# EasyEDA Pro project ProDoc_Board_ZL_C-TH_v1.epro

# Board Tester-TH
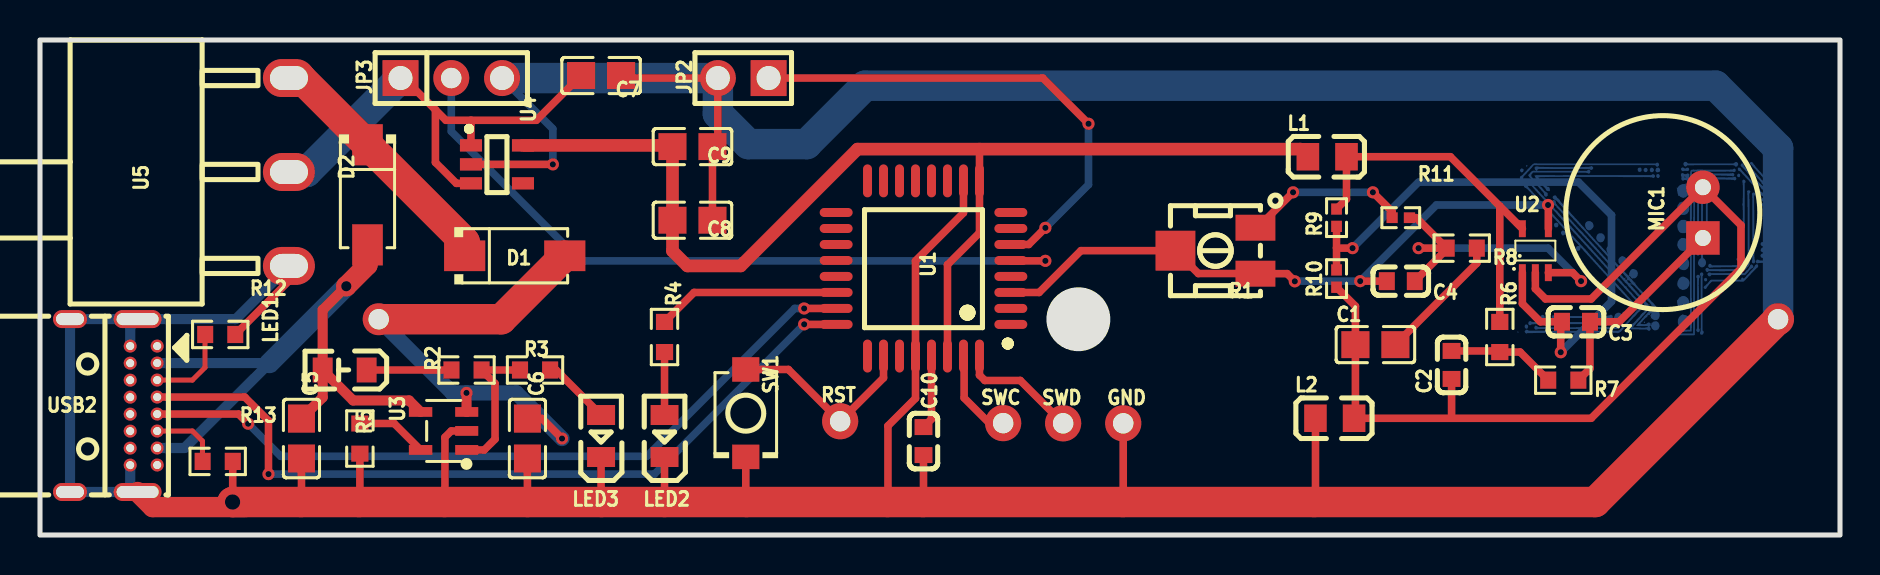
[diagram p0: board, top side]
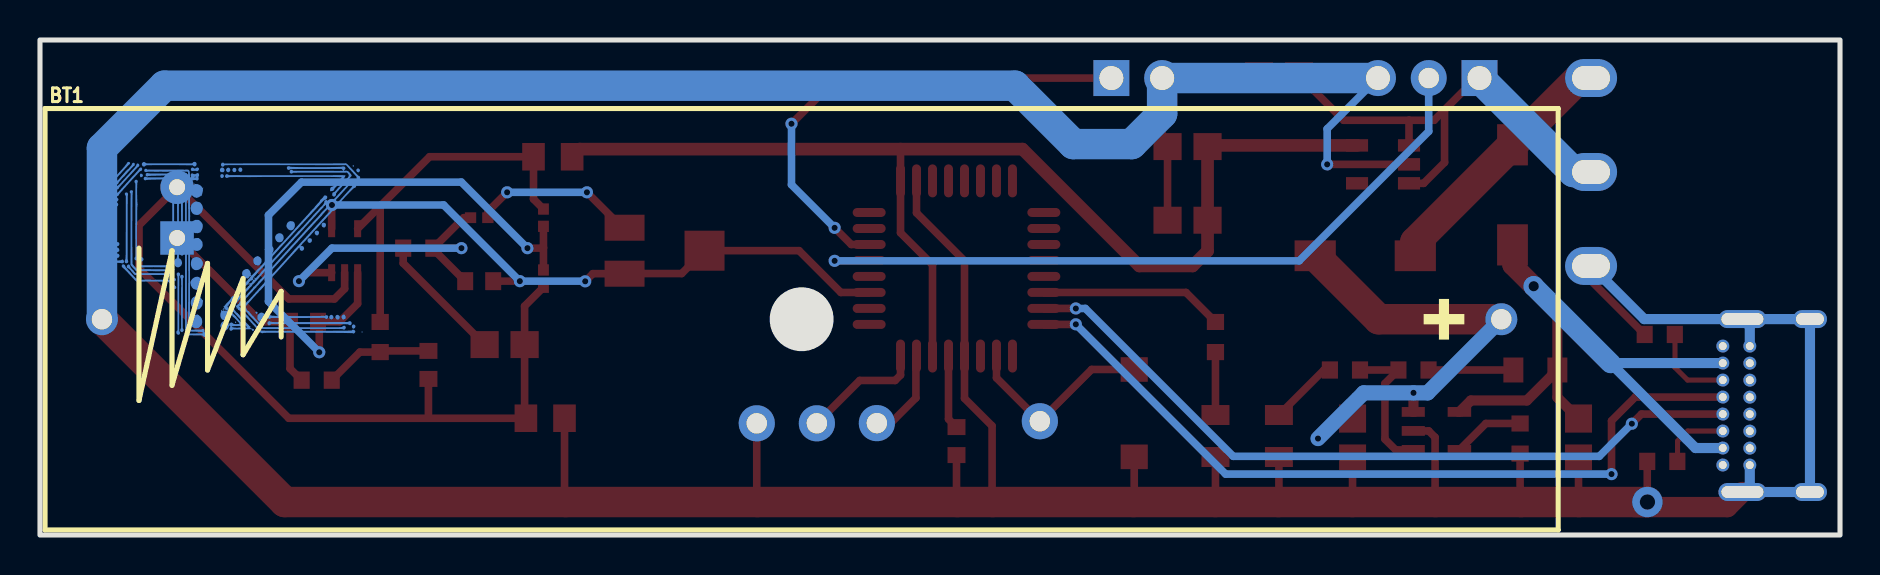
[diagram p1: board, bottom side, seen from below]

Outline 90.04 x 24.77 mm; copper layers: Top Layer, Bottom Layer. Coordinates in mm from the lower left corner of the outline.
Outline path: rectangle 0,24.77 90.04,0
Stack: Top Layer 0.035mm / Dielectric1 1.51mm FR4 er 4.5 / Bottom Layer 0.035mm

## Design rules (mm)
template: JLCPCB Capability(Two Layers Board)
spacing copperThickness1oz (default): track to track 0.102, other pairs 0.152 to 0.3
spacing copperThickness2oz: track to track 0.203, other pairs 0.152 to 0.3
track width copperThickness1oz (default): min 0.127, default 0.254, max 2.54
track width copperThickness2oz: min 0.203, default 0.254, max 2.54
differential pair differentialPair (default): width min 0.127, default 0.254, max 2.54; gap min 0.152, default 0.152
via viaSize (default): diameter min 0.5, default 0.61, max 10; hole min 0.3, default 0.305, max 6.3

## Placement (name value [footprint] x y rotation side)
BT1  BH-18650-1  [BAT-TH_BH-18650-A1AJ005]  51.94 10.8 180 bottom
C1  10uF  [C0805]  66.8 9.53 0 top
C2  100nF  [C0603]  70.61 8.51 90 top
C3  10nF  [C0603]  76.84 10.67 180 top
C4  100pF  [C0603]  68.07 12.7 180 top
C5  10uF  [C0805]  13.08 4.83 270 top
C6  10uF  [C0805]  24.38 4.83 270 top
C7  10uF  [C0805]  28.07 22.99 180 top
C8  10uF  [C0805]  32.64 15.75 180 top
C9  1uF  [C0805]  32.64 19.43 180 top
C10  1uF  [C0603]  44.2 4.7 270 top
D1  SS54  [SMA_L4.4-W2.8-LS5.4-R-RD]  23.75 13.97 0 top
D2  SS54  [SMA_L4.4-W2.8-LS5.4-R-RD]  16.38 17.02 270 top
GND  SWD1  [CON_PAD_ROUND_1.02MM]  54.19 5.59 0 top
JP2  2-Pin  [HDR-TH_2P-P2.54-V-M-2]  35.18 22.86 90 top
JP3  3-Pin  [HDR-TH_3P-P2.54-V-F_MF254V-11-03-0743]  20.57 22.86 0 top
L1  BLM21PG221SN1D  [L0805]  64.39 18.92 0 top
L2  BLM21PG221SN1D  [L0805]  64.77 5.84 0 top
LED1  CHG Orange  [LED0805-RD_ORANGE]  15.24 8.26 180 top
LED2  PWR Red  [LED0805-R-RD]  31.24 4.95 90 top
LED3  CHGD Green  [LED0805-R-RD]  28.07 4.95 90 top
MIC1  GMI9767P-60DB  [MIC-TH_BD9.7-P2.54-D0.8-L-FD]  83.19 16.13 90 top
R1  100kΩ  [RES-ADJ-SMD_3P-L4.5-W4.5-P2.30-BL-FS]  58.8 14.22 180 top
R2  470Ω  [R0603]  21.34 8.26 0 top
R3  470Ω  [R0603]  24.77 8.26 180 top
R4  1kΩ  [R0603]  31.24 9.91 270 top
R5  1kΩ  [R0603]  16 4.83 270 top
R6  1kΩ  [R0603]  73.03 9.91 270 top
R7  1kΩ  [R0603]  76.2 7.75 180 top
R8  1kΩ  [R0603]  71.12 14.35 180 top
R9  1MΩ  [R0402]  64.86 15.88 90 top
R10  1MΩ  [R0402]  64.86 12.83 90 top
R11  22kΩ  [R0402]  68.07 15.88 180 top
R12  5.1kΩ  [R0603]  9.02 10.03 0 top
R13  5.1kΩ  [R0603]  8.89 3.68 0 top
RST  TP1  [CON_PAD_ROUND_1.02MM]  40.03 5.69 0 top
SW1  RST  [SW-SMD_L3.9-W3.0-P4.45]  35.31 6.1 270 top
SWC  SWC1  [CON_PAD_ROUND_1.02MM]  48.18 5.6 0 top
SWD  SWD1  [CON_PAD_ROUND_1.02MM]  51.18 5.59 0 top
U1  ATSAMD21E17A-AU  [TQFP-32_L7.0-W7.0-P0.80-LS9.0-BL]  44.2 13.34 90 top
U2  MAX4466EXK+T  [SC-70-5_L2.0-W1.3-P0.65-LS2.1-BR]  74.8 14.22 270 top
U3  MCP73831T-2ACI/OT  [SOT-23-5_L3.0-W1.7-P0.95-LS2.8-BL]  20.19 5.21 90 top
U4  AP2112K-3.3TRG1  [SOT-25-5_L2.9-W1.6-P0.95-LS2.8-BL]  22.86 18.54 270 top
U5  SW Power  [SW-TH_SS-12M12G5]  12.45 18.16 90 top
USB2  USB4085-GF-A  [USC-C-SMD_USB4085-GF-A]  3.68 6.48 270 top

## Footprints (pads in the part's own frame, mm; a bottom-side part is the same pattern mirrored in y, then rotated)
BAT-TH_BH-18650-A1AJ005
  round 1.6 hole 1.02: 1(-35,0) 2(35,0)
C0603
  rect 0.8x0.9 smd: 1(-0.7,0) 2(0.7,0)
C0805
  rect 1.41x1.35 smd: 1(-1,0) 2(1,0)
CON_PAD_ROUND_1.02MM
  round 1.811 hole 1.021: P(0,0)
HDR-TH_2P-P2.54-V-M-2
  rect 1.8x1.8 hole 1.2: 1(0,-1.27)
  round 1.8 hole 1.2: 2(0,1.27)
HDR-TH_3P-P2.54-V-F_MF254V-11-03-0743
  rect 1.801x1.801 hole 1.199: 1(-2.54,0)
  round 1.801 hole 1.02: 2(0,0)
  round 1.801 hole 1.199: 3(2.54,0)
L0805
  rect 1.133x1.377 smd: 1(-0.966,0) 2(0.966,0)
LED0805-R-RD
  rect 1x1.399 smd: 1(1.05,0) 2(-1.05,0)
LED0805-RD_ORANGE
  rect 1x1.25 smd: 1(-1.1,0) 2(1.1,0)
MIC-TH_BD9.7-P2.54-D0.8-L-FD
  rect 1.677x1.677 hole 0.8: 1(-1.27,0)
  round 1.677 hole 0.8: 2(1.27,0)
R0402
  rect 0.566x0.54 smd: 1(-0.433,0) 2(0.433,0)
R0603
  rect 0.806x0.864 smd: 1(-0.753,0) 2(0.753,0)
RES-ADJ-SMD_3P-L4.5-W4.5-P2.30-BL-FS
  rect 2x1.3 smd: 1(-2,-1.15) 3(-2,1.15)
  rect 2x2 smd: 2(2,0)
SC-70-5_L2.0-W1.3-P0.65-LS2.1-BR
  rect 0.85x0.35 smd: 1(1.1,-0.65) 2(1.1,0) 3(1.1,0.65) 4(-1.1,0.65) 5(-1.1,-0.65)
SMA_L4.4-W2.8-LS5.4-R-RD
  rect 2.062x1.539 smd: 1(2.503,0) 2(-2.503,0)
SOT-23-5_L3.0-W1.7-P0.95-LS2.8-BL
  rect 0.49x1.157 smd: 1(-0.95,-1.153) 2(0,-1.153) 3(0.95,-1.153)
  rect 0.49x1.175 smd: 4(0.95,1.153) 5(-0.95,1.153)
SOT-25-5_L2.9-W1.6-P0.95-LS2.8-BL
  rect 0.623x1.105 smd: 1(-0.95,-1.3) 2(-0.001,-1.3) 3(0.95,-1.3) 4(0.95,1.3) 5(-0.95,1.3)
SW-SMD_L3.9-W3.0-P4.45
  rect 1.23x1.36 smd: 1(-2.185,0) 2(2.185,0)
SW-TH_SS-12M12G5
  oval 1.9x2.6 hole 1.2x1.9: 1(-4.7,0) 2(0,0) 3(4.7,0)
TQFP-32_L7.0-W7.0-P0.80-LS9.0-BL
  oval 0.45x1.65 smd: 1(-2.8,-4.369) 2(-2,-4.369) 3(-1.2,-4.369) 4(-0.4,-4.369) 5(0.4,-4.369) 6(1.2,-4.369) 7(2,-4.369) 8(2.8,-4.369) 17(2.8,4.369) 18(2,4.369) 19(1.2,4.369) 20(0.4,4.369) 21(-0.4,4.369) 22(-1.2,4.369) 23(-2,4.369) 24(-2.8,4.369)
  oval 1.65x0.45 smd: 9(4.381,-2.8) 10(4.381,-2) 11(4.381,-1.2) 12(4.381,-0.4) 13(4.381,0.4) 14(4.381,1.2) 15(4.381,2) 16(4.381,2.8) 25(-4.381,2.8) 26(-4.381,2) 27(-4.381,1.2) 28(-4.381,0.4) 29(-4.381,-0.4) 30(-4.381,-1.2) 31(-4.381,-2) 32(-4.381,-2.8)
USC-C-SMD_USB4085-GF-A
  round 0.65 hole 0.4: A1(-2.975,2.18) A4(-2.125,2.18) A5(-1.275,2.18) A6(-0.425,2.18) A7(0.425,2.18) A8(1.275,2.18) A9(2.125,2.18) A12(2.975,2.18) B1(2.98,0.83) B4(2.13,0.83) B5(1.28,0.83) B6(0.43,0.83) B7(-0.42,0.83) B8(-1.27,0.83) B9(-2.12,0.83) B12(-2.975,0.83)
  oval 0.9x2.4 hole 0.6x2.1: S1(-4.325,1.2) S1(4.325,1.2)
  oval 0.9x1.7 hole 0.6x1.4: S1(-4.325,-2.18) S1(4.325,-2.18)

## Nets
3.3V: C8.2 C9.2 L1.1 U1.9 U1.30 U4.5
AGND: C1.1 C2.1 L2.2 MIC1.2 R10.1 U2.2
AVCC: L1.2 R6.1 R9.2 U2.5
GND: BT1.1 C5.2 C6.2 C7.1 C8.1 C9.1 C10.2 GND.P JP2.2 JP3.3 L2.1 LED2.2 LED3.2 R5.2 R12.2 R13.2 SW1.2 U1.10 U1.28 U3.2 U4.2 U5.1 USB2.B1 USB2.B12 USB2.S1
VBAT: BT1.2 C6.1 D1.1 U3.3
VBUS: C5.1 D2.1 LED1.2 U3.4 USB2.A4 USB2.A9
A0: C4.2 R1.2 R1.3 U1.3 U2.4
D0: JP3.2 U1.5
D1: JP2.1 U1.6
D13: R4.1 U1.22
D+: U1.24 USB2.A6
D-: U1.23 USB2.A7
VHIGH: D1.2 D2.2 U5.3
VOUT: C7.2 JP3.1 U4.1 U4.3 U5.2
$1N3319: SWD.P U1.32
$1N3328: SWC.P U1.31
$1N3455: C10.1 U1.29
$1N3478: RST.P SW1.1 U1.26
$1N3593: LED2.1 R4.2
$1N3882: LED1.1 R2.1
$1N3983: LED3.1 R3.1
$1N3989: R2.2 R3.2 U3.1
$1N4074: R5.1 U3.5
$1N4284: C3.2 R9.1 R10.2 U2.1
$1N4286: C3.1 MIC1.1 R7.1
$1N4288: C2.2 R6.2 R7.2
$1N4367: C4.1 R8.2 R11.1 U2.3
$1N4374: C1.2 R8.1
$1N4382: R1.1 R11.2
$1N5905: R13.1 USB2.A8
$1N5939: R12.1 USB2.A5

Pads without a net: U1 1 2 4 7 8 11 12 13 14 15 16 17 18 19 20 21 25 27; U4 4; USB2 A1 A12 B4 B5 B6 B7 B8 B9

## Via types
v1: diameter 1.524, hole 0.762, Top Layer to Bottom Layer, 1 via
v2: diameter 0.61, hole 0.305, Top Layer to Bottom Layer, 19 vias
v3: diameter 1.016, hole 0.508, Top Layer to Bottom Layer, 1 via

## Routing (per net, layer and track width the routed paths; a pad name or vN(x,y) marks a point on that pad's centre or on a via; arc(x,y) is an arc through that point)
3.3V: length 58.4
  Top Layer w0.381: U1.30 45.4,13.52 47,15.12 U1.9 47,19.3
  Top Layer w0.635: U4.5 31.58,19.49 C9.2 C8.2 31.64,14.21 32.38,13.46 35.05,13.46 40.89,19.3 63.04,19.3 L1.1
AGND: length 48
  Top Layer w0.381: C2.1 70.61,5.86 70.6,5.84 ; 70.6,5.84 77.6,5.84 85.09,13.34 85.09,15.49 MIC1.2 77.6,11.81 75.31,11.81 74.8,12.32 U2.2 ; 70.6,5.84 L2.2 65.8,5.91 C1.1 65.8,11.45 R10.1
AVCC: length 18.9
  Top Layer w0.381: R6.1 73.03,16.45 ; 73.03,16.45 70.55,18.92 L1.2 65.36,16.81 R9.2 ; 73.03,16.45 U2.5
GND: length 265.6
  Top Layer w0.381: LED3.2 28.07,1.68 28.09,1.65 ; C7.1 29.19,22.86 JP2.2 33.91,19.7 C9.1 C8.1 ; L2.1 63.8,1.72 63.74,1.65 ; 24.39,1.65 24.38,1.66 C6.2 ; C5.2 13.08,1.68 13.06,1.65 ; C10.2 44.2,1.68 44.17,1.65 ; 54.16,1.65 54.19,1.67 GND.P ; LED2.2 31.24,1.65 31.25,1.65 ; U5.1 12.45,12.72 R12.2 ; 42.38,1.65 42.42,1.69 42.42,5.46 43.8,6.84 U1.28 43.8,13.72 46.2,16.12 U1.10 ; R5.2 16,1.7 15.96,1.65 ; SW1.2 35.31,1.69 35.34,1.65 ; R13.2 9.64,1.66 v1(9.63,1.65) ; 20.24,1.65 20.26,1.67 20.26,4.89 20.57,5.21 U3.2 ; v2(25.65,18.54) U4.2
  Top Layer w1.016: USB2.S1 5.64,1.4 10.29,1.4
  Top Layer w1.524: v1(9.63,1.65) 77.8,1.65 BT1.1
  Bottom Layer w0.381: v2(25.65,18.54) 25.65,20.32 JP3.3
  Bottom Layer w0.508: U5.1 9.79,10.8 USB2.S1 ; USB2.S1 USB2.S1 USB2.S1 USB2.S1 4.51,2.52 USB2.B1 ; USB2.S1 4.51,10.43 USB2.B12
  Bottom Layer w1.524: JP3.3 JP2.2 33.91,21.08 35.43,19.56 38.35,19.56 41.28,22.48 83.82,22.48 86.94,19.36 BT1.1
VBAT: length 25.4
  Top Layer w0.381: C6.1 25.11,5.83 v2(26.11,4.83)
  Top Layer w0.508: v2(21.34,7.11) 21.34,6.17 U3.3
  Top Layer w1.524: BT1.2 23.08,10.8 D1.1
  Bottom Layer w0.762: v2(26.11,4.83) 23.83,7.11 v2(21.34,7.11) 20.63,7.11 BT1.2
VBUS: length 34.3
  Top Layer w0.508: LED1.2 14.14,11.26 v3(15.32,12.45) ; LED1.2 15.66,6.73 18.47,6.73 U3.4 ; LED1.2 14.14,6.89 C5.1
  Top Layer w1.016: D2.1 16.38,13.51 v3(15.32,12.45)
  Bottom Layer w0.508: USB2.A4 11.48,8.6 7.23,4.35 USB2.A9
  Bottom Layer w1.016: 11.48,8.6 v3(15.32,12.45)
A0: length 32.5
  Top Layer w0.381: U1.3 49.98,12.14 52.07,14.22 R1.2 57.94,13.08 60.79,13.08 60.8,13.07 62.39,13.07 v2(62.77,12.69) ; v2(75.44,16.51) 75.45,16.5 U2.4 ; v2(66.04,12.7) C4.2
  Bottom Layer w0.381: v2(75.44,16.51) 69.85,16.51 v2(66.04,12.7) 62.78,12.7 v2(62.77,12.69)
D0: length 36.8
  Top Layer w0.381: U1.5 48.58,13.72 v2(50.29,13.72)
  Bottom Layer w0.381: JP3.2 20.57,20.19 27.05,13.72 v2(50.29,13.72)
D1: length 25.1
  Top Layer w0.381: v2(52.45,20.57) 50.16,22.86 JP2.1 ; U1.6 49.46,14.54 v2(50.29,15.37)
  Bottom Layer w0.381: v2(50.29,15.37) 52.45,17.53 v2(52.45,20.57)
D13: length 9.2
  Top Layer w0.381: U1.22 32.72,12.14 R4.1
D+: length 40.2
  Top Layer w0.381: v2(38.23,10.54) 38.23,10.54 U1.24 ; v2(11.43,3.05) 11.43,5.72 10.24,6.9 USB2.A6
  Bottom Layer w0.381: v2(11.43,3.05) 30.73,3.05 v2(38.23,10.54)
D-: length 37.9
  Top Layer w0.381: USB2.A7 9.93,6.05 v2(10.41,5.57) ; U1.23 38.23,11.34 v2(38.23,11.33)
  Bottom Layer w0.381: v2(10.41,5.57) 12.05,3.94 30.35,3.94 37.75,11.33 v2(38.23,11.33)
VHIGH: length 12.9
  Top Layer w1.524: U5.3 13.04,22.86 D2.2 21.25,14.66 D1.2
VOUT: length 24.5
  Top Layer w0.381: C7.2 24.83,20.75 21.56,20.75 ; 21.56,20.75 20.3,20.75 19.78,21.27 ; 21.56,20.75 U4.1 ; 19.78,21.27 19.78,18.64 20.83,17.59 U4.3 ; 19.78,21.27 18.19,22.86 JP3.1
  Bottom Layer w1.524: U5.2 13.34,18.16 JP3.1
$1N3319: length 6.1
  Top Layer w0.381: SWD.P 49.04,7.73 47.27,7.73 47,8 U1.32
$1N3328: length 4.6
  Top Layer w0.381: SWC.P 47.49,5.6 46.23,6.86 46.23,8.92 U1.31
$1N3455: length 3.7
  Top Layer w0.381: C10.1 44.6,5.8 U1.29
$1N3478: length 10
  Top Layer w0.381: U1.26 42.2,7.86 RST.P 37.44,8.28 SW1.1
$1N3593: length 3.1
  Top Layer w0.381: R4.2 LED2.1
$1N3882: length 4.2
  Top Layer w0.381: R2.1 LED1.1
$1N3983: length 3.5
  Top Layer w0.381: R3.1 25.82,8.26 LED3.1
$1N3989: length 7.3
  Top Layer w0.381: U3.1 22.23,4.26 22.76,4.8 22.76,7.58 R2.2 R3.2
$1N4074: length 3.6
  Top Layer w0.381: U3.5 17.72,5.58 R5.1
$1N4284: length 31.4
  Top Layer w0.381: v2(76.07,9.14) 76.07,10.61 C3.2 75.06,10.67 74.15,11.57 U2.1 ; 64.86,14.37 64.88,14.35 v2(65.66,14.35) ; 64.86,14.37 64.86,13.26 ; 64.86,14.37 64.86,15.44
  Bottom Layer w0.381: v2(65.66,14.35) 68.96,17.65 76.96,17.65 78.61,16 78.61,11.68 v2(76.07,9.14)
$1N4286: length 10.5
  Top Layer w0.381: R7.1 77.53,8.33 C3.1 78.99,10.67 MIC1.1
$1N4288: length 5.4
  Top Layer w0.381: R7.2 74.04,9.15 R6.2 72.97,9.21 C2.2
$1N4367: length 16.8
  Top Layer w0.381: R8.2 70.37,14.29 C4.1 ; R8.2 v2(68.96,14.35) ; R8.2 68.84,15.88 R11.1 ; U2.3 76.66,13.12 v2(77.09,12.7)
  Bottom Layer w0.381: v2(68.96,14.35) 75.44,14.35 v2(77.09,12.7)
$1N4374: length 6.5
  Top Layer w0.381: R8.1 71.87,13.6 C1.2
$1N4382: length 8.3
  Top Layer w0.381: R1.1 60.91,15.37 v2(62.68,17.15) ; v2(66.68,17.15) 67.64,16.18 R11.2
  Bottom Layer w0.381: v2(62.68,17.15) v2(66.68,17.15)
$1N5905: length 3.5
  Top Layer w0.254: 5.86,5.2 7.62,5.2 8.13,4.7 8.13,3.69 R13.1
$1N5939: length 4.3
  Top Layer w0.254: USB2.A5 7.62,7.75 8.26,8.38 8.26,10.02 R12.1

Small or netless copper shapes (teardrops, artwork), in the pictures only: 65 on Bottom Layer
